# Altium project Proyecto.PrjPcb
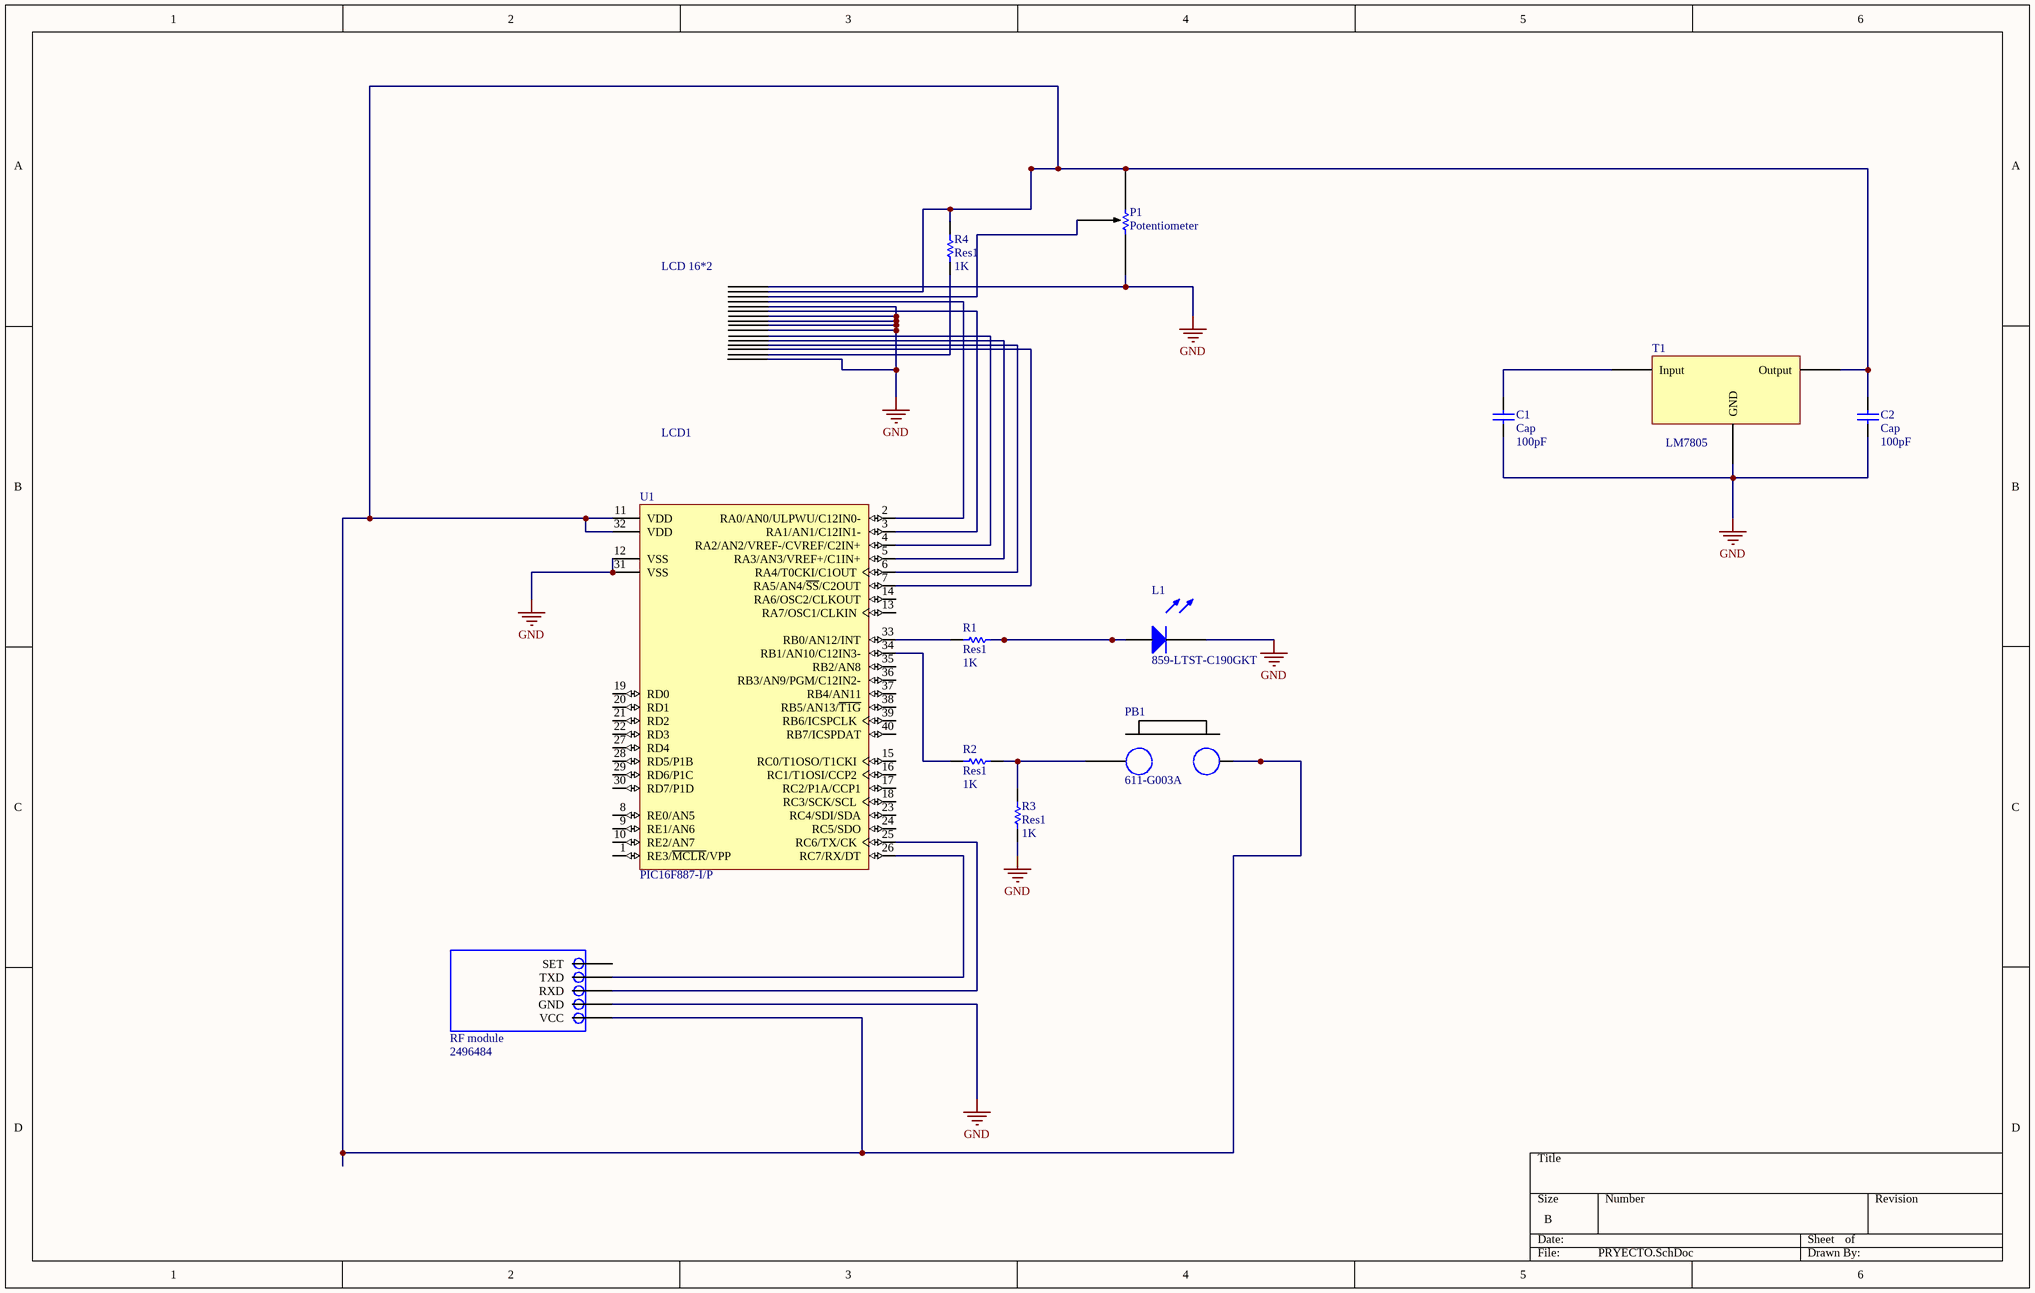
[diagram p0: PRYECTO.SchDoc]
2 sheets, 24 parts. Net scope: global (net labels, ports and power ports of the same name join across sheets).
Board files: FINAL.PcbDoc, Receptorpcb.PcbDoc
Sheets:
  PRYECTO.SchDoc
  RECEPTOR.SchDoc

## Sheet PRYECTO.SchDoc
size B

### Parts
(Parts that share a designator on the sheet are numbered #1, #2 ... from top to bottom, then left to right.)
C1#1  Cap  value 100pF  [RAD-0.3]
C2#1  Cap  value 100pF  [RAD-0.3]
L1#1  Supplier Part Number 1: 859-LTST-C190GKT  [LED]  (hidden comment: LED)
LCD1  LCD 16*2  [LCD]
P1  Potentiometer  [Potentiometer]
PB1#1  Supplier Part Number 1: 611-G003A  [Push Button]  (hidden comment: Push Button 2-Pin)
R1#1  Res1  value 1K  [AXIAL-0.3]
R2#1  Res1  value 1K  [AXIAL-0.3]
R3  Res1  value 1K  [AXIAL-0.3]
R4  Res1  value 1K  [AXIAL-0.3]
T1#1  LM7805  [LM7805]
U1#1  PIC16F887-I/P  [PDIP600-P40]
U2#1  RF module  Supplier Part Number 1: 2496484  [HC-12]

### Nets
GND: C1#1.1 C2#1.1 L1#1.2 LCD1.D0 LCD1.D1 LCD1.D2 LCD1.D3 LCD1.K LCD1.RW LCD1.VSS P1.3 R3.1 T1#1.Ground(GND) U1#1.12(VSS) U1#1.31(VSS) U2#1.4(GND)
NetC1#1_2: C1#1.2 T1#1.Input
NetC2#1_2: C2#1.2 LCD1.VDD P1.1 PB1#1.2 R4.2 T1#1.Output U1#1.11(VDD) U1#1.32(VDD) U2#1.5(VCC)
NetL1#1_1: L1#1.1 R1#1.2
NetLCD1_A: LCD1.A R4.1
NetLCD1_D4: LCD1.D4 U1#1.4(RA2/AN2/VREF-/CVREF/C2IN+)
NetLCD1_D5: LCD1.D5 U1#1.5(RA3/AN3/VREF+/C1IN+)
NetLCD1_D6: LCD1.D6 U1#1.6(RA4/T0CKI/C1OUT)
NetLCD1_D7: LCD1.D7 U1#1.7(RA5/AN4/~{SS}/C2OUT)
NetLCD1_E: LCD1.E U1#1.3(RA1/AN1/C12IN1-)
NetLCD1_RS: LCD1.RS U1#1.2(RA0/AN0/ULPWU/C12IN0-)
NetLCD1_V0: LCD1.V0 P1.2
NetPB1#1_1: PB1#1.1 R2#1.2 R3.2
NetR1#1_1: R1#1.1 U1#1.33(RB0/AN12/INT)
NetR2#1_1: R2#1.1 U1#1.34(RB1/AN10/C12IN3-)
NetU1#1_25: U1#1.25(RC6/TX/CK) U2#1.3(RXD)
NetU1#1_26: U1#1.26(RC7/RX/DT) U2#1.2(TXD)

Not connected (* = marked no-connect by the designer): U1#1 1(RE3/~{MCLR}/VPP) 8(RE0/AN5) 9(RE1/AN6) 10(RE2/AN7) 13(RA7/OSC1/CLKIN) 14(RA6/OSC2/CLKOUT) 15(RC0/T1OSO/T1CKI) 16(RC1/T1OSI/CCP2) 17(RC2/P1A/CCP1) 18(RC3/SCK/SCL) 19(RD0) 20(RD1) 21(RD2) 22(RD3) 23(RC4/SDI/SDA) 24(RC5/SDO) 27(RD4) 28(RD5/P1B) 29(RD6/P1C) 30(RD7/P1D) 35(RB2/AN8) 36(RB3/AN9/PGM/C12IN2-) 37(RB4/AN11) 38(RB5/AN13/~{T1G}) 39(RB6/ICSPCLK) 40(RB7/ICSPDAT); U2#1 1(SET)

### Library data of the parts
C1#1 C2#1 = Cap: Capacitor Ceramico; Manufacturer: KEMET; Manufacturer Part Number: C0402C104K8PACTU; Capacitance: 100nF; Tolerance: 10%; Voltage Rating: 10V; Dielectric: X5R; Dissipation Factor: 5%; Published: 8-Jun-2000; LatestRevisionDate: 17-Jul-2002; LatestRevisionNote: Re-released for DXP Platform.; PackageReference: RAD-0.3; Publisher: Altium Limited; PackageDescription: Radial Cap, Thru-Hole; 2 Leads; 0.3 in Pin Spacing; Supplier 1: Arrow; Stock 1: 0; Mount: PCB,Surface Mount; Case/Package: 0402; Number of Pins: 2; Case Code (Metric): 1005; Case Code (Imperial): 0402; Dielectric Material: Ceramic; Contact Plating: Matte,Tin; Min Operating Temperature: -55°C; Max Operating Temperature: 85°C; Voltage Rating (DC): 10V; Package Quantity: 1; Packaging: Tape and Reel; Termination: SMD/SMT; Voltage: 10V; Length: 1mm; Height: 0.5mm; Width: 0.02inch; Depth: 0.5mm; Thickness: 0.022inch; Lead Pitch: 0.3mm; Radiation Hardening: No; REACH SVHC: No SVHC; Lead Free: Lead Free; Supplier Part Number 1: C0402C104K8PAC7867
L1#1 = LED: Manufacturer: Vishay Lite-On; Manufacturer Part Number: LTST-C190GKT; Colour: Green; Lens Colour: Clear,Colorless; Luminous Intensity: 6mcd; Forward Voltage: 2.1V; Viewing Angle: 130°; Lens Style: Clear,Colorless,Diffused,Rectangular; Forward Current: 30mA; Test Current: 10mA; Number of Elements: 1; Power Dissipation: 100mW; Reverse Voltage: 5V; Dominant Wavelength: 569nm; Wavelength: 565nm; Lens Transparency: Clear; Voltage: 2V; Current: 1A; Supplier 1: Mouser; Stock 1: 402291; Pricing 1: 1=0.25, 10=0.13, 50=0.13, 100=0.061, 1000=0.045, 10000=0.034 (USD); Mount: Surface Mount; Case/Package: 0603; Number of Pins: 2; Case Code (Metric): 1608; Case Code (Imperial): 0603; Min Operating Temperature: -55°C; Max Operating Temperature: 85°C; Package Quantity: 1; Packaging: Tape and Reel; Illumination Colour: Green; Number of LEDs: 1; Power Rating: 100mW; Length: 1.6mm; Height: 0.8mm; Width: 0.8mm; Depth: 0.8mm; Radiation Hardening: No; Lead Free: Lead Free
LCD1 = LCD: Manufacturer: Newhaven Display; Manufacturer Part Number: NHD-0216K3Z-FL-GBW-V3; Interface: I2C,RS-232,SPI; Operating Supply Voltage: 5V; Backlight Type: LED; Number of Characters: 32; Background Colour: Green; Supplier 1: Allied Electronics; Stock 1: 0; Min Operating Temperature: -20°C; Max Operating Temperature: 70°C; Package Quantity: 100; Supplier Part Number 1: 70518162
P1 = Potentiometer: Manufacturer: Bourns; Manufacturer Part Number: 91A1A-G28-B15L; Resistance: 10kR; Tolerance: 20%; Power Rating: 500mW; Number of Gangs: 1; Temperature Coefficient: 1000ppm/°C; Voltage Rating: 1.5kV; Max Power Dissipation: 1W; Actuator Length: 0.875inch; Actuator Diameter: 0.25inch; Hole Diameter: 9.525mm; Supplier 1: Mouser; Stock 1: 86; Pricing 1: 1=7.31, 10=7.05, 50=5.75, 100=5.22, 1000=3.53, 10000=3.53 (USD); Mount: Panel,Through Hole; Case/Package: Metal; Weight: 0.447979oz; Min Operating Temperature: -40°C; Max Operating Temperature: 125°C; Composition: Conductive Plastic; Termination: Pin; Number of Turns: 1; Packaging: Bulk; Package Quantity: 5; Taper: Linear; Voltage Rating (DC): 1.5kV; Length: 15.88mm; Width: 15.88mm; Depth: 22.86mm; REACH SVHC: No SVHC; Supplier Part Number 1: 652-91A1A-G28-B15L
PB1#1 = Push button: Manufacturer: ITT C&K; Manufacturer Part Number: G003A; Shape: Round; Illumination Type: Non-Illuminated; Illumination Colour: Black; Supplier 1: Mouser; Stock 1: 2542; Pricing 1: 1=0.44, 10=0.44, 50=0.425, 100=0.416, 1000=0.296, 10000=0.28 (USD); Colour: Black; Packaging: Bulk; Package Quantity: 500; Diameter: 6.2mm; Height: 9.04mm; Radiation Hardening: No; Lead Free: Lead Free
R1#1 R2#1 R3 R4 = Res1: Resistor; Published: 8-Jun-2000; LatestRevisionDate: 17-Jul-2002; LatestRevisionNote: Re-released for DXP Platform.; PackageReference: AXIAL-0.3; Publisher: Altium Limited; PackageDescription: Axial Device, Thru-Hole; 2 Leads; 0.3 in Pin Spacing
T1#1 = LM7805: Voltage Regulator; Manufacturer: ON Semiconductor / Fairchild; Manufacturer Part Number: LM7805CT; Output Voltage: 5V; Number of Outputs: 1; Max Input Voltage: 35V; Polarity: Positive; Output Type: Fixed; Output Current: 1A; Min Input Voltage: 7V; Quiescent Current: 8mA; Dropout Voltage: 2V; Accuracy: 4%; Power Supply Rejection Ratio (PSRR): 73dB; Max Output Voltage: 5.2V; Supplier 1: Newark; Stock 1: 0; Mount: Through Hole; Case/Package: TO-220-3; Number of Pins: 3; Weight: 1.214g; Min Operating Temperature: -40°C; Max Operating Temperature: 125°C; Packaging: Rail/Tube; Package Quantity: 50; Number of Regulators: 1; Output Voltage Accuracy: 4%; Max Output Current: 1A; Current Rating: 1A; Nominal Output Voltage: 5V; Min Output Voltage: 5V; Length: 10.67mm; Height: 16.3mm; Width: 4.7mm; Radiation Hardening: No; Lead Free: Lead Free; REACH SVHC: No SVHC; Supplier Part Number 1: 34C1092
U1#1 = PIC16F887-I/P: Flash-Based, 8-Bit CMOS Microcontroller with nanoWatt Technology, 8K (x14-Bit words) Program Memory, 624 Bytes Data Memory, 35 I/O pins, 40-Pin PDIP, Standard VDD Range, Industrial Temperature; Published: 29-Jan-2009; LatestRevisionDate: 02-Dec-2009; LatestRevisionNote: Updated datasheet to version revF, Apr-2009.; DatasheetVersion: revF, Apr-2009; PackageVersion: revBB, Aug-2009; PackageReference: PDIP600-P40; Publisher: Altium Limited; PackageDescription: 40-Lead Plastic Dual In-Line (P) - 600 mil Body [PDIP]; Supplier 1: Digi-Key; Supplier Part Number 1: PIC16F887-I/P-ND; Supplier 2: Farnell; Supplier Part Number 2: 1439541; ComponentLink1Description: Datasheet; ComponentLink1URL: http://ww1.microchip.com/downloads/en/DeviceDoc/41291F.pdf; ComponentLink2Description: Packaging Specification; ComponentLink2URL: http://www.microchip.com/stellent/groups/techpub_sg/documents/packagingspec/en012702.pdf; ComponentLink3Description: Microchip.com Home; ComponentLink3URL: http://www.microchip.com/
U2#1 = HC-12: HC-11 1000m; Manufacturer: Microchip; Manufacturer Part Number: MRF89XAM8A-I/RM; Max Supply Voltage: 3.6V; Min Supply Voltage: 2.1V; Operating Supply Voltage: 3.3V; Data Rate: 40Kbps; Number of Channels: 59; Nominal Supply Current: 25mA; Interface: SPI; Frequency: 870MHz; Sensitivity: -113dBm; Current - Receiving: 3mA; Logic Function: Transceiver; Propagation Delay: 25ns; Number of Transmitters: 1; Simplex/Duplex: Half Duplex; Operating Supply Current: 18mA; Mount: Surface Mount; Case/Package: Module; Number of Pins: 12; Contact Plating: Matte,Tin; Min Operating Temperature: -40°C; Max Operating Temperature: 85°C; Packaging: Tray; Package Quantity: 54; Max Frequency: 870MHz; Current - Transmitting: 25mA; Length: 27.94mm; Height: 0.075inch; Width: 0.7inch; Depth: 17.78mm; Radiation Hardening: No; Lead Free: Lead Free; REACH SVHC: No SVHC; Supplier 1: Farnell; Stock 1: 13; Pricing 1: 1=49.59, 5=48.04, 10=47.12, 25=40.3 (GBP); Weight: 0.004706oz; Number of Receivers: 1; Number of Drivers: 1; Number of Transceivers: 1

## Sheet RECEPTOR.SchDoc
size A
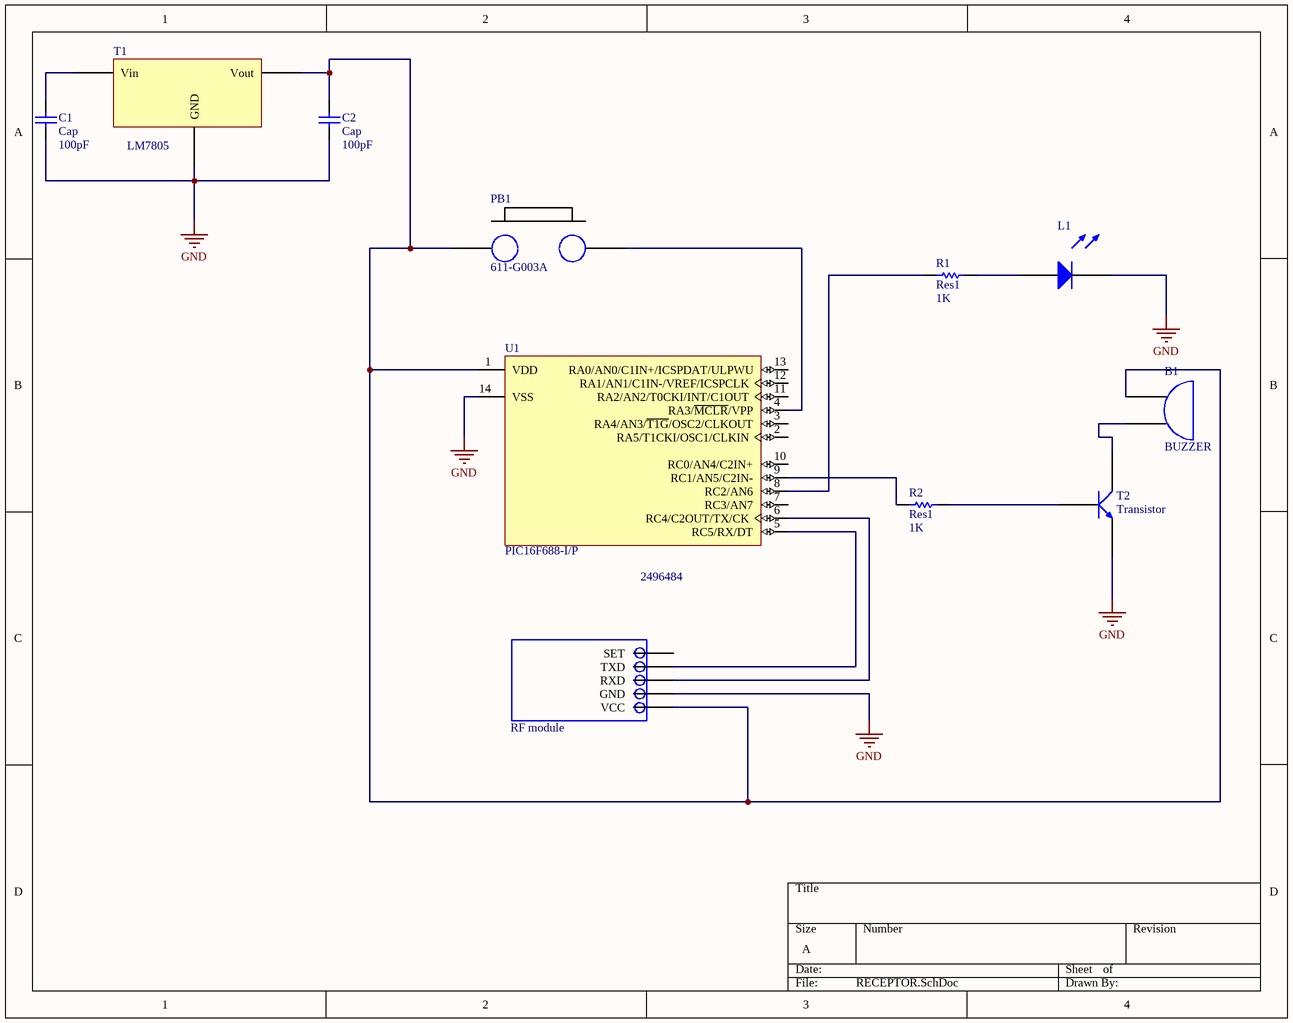
[diagram p1: RECEPTOR.SchDoc]

### Parts
(Parts that share a designator on the sheet are numbered #1, #2 ... from top to bottom, then left to right.)
B1  BUZZER  [Buzzer]
C1#2  Cap  value 100pF  [RAD-0.3]
C2#2  Cap  value 100pF  [RAD-0.3]
L1#2  LED  [LED]  (value not drawn)
PB1#2  Supplier Part Number 1: 611-G003A  [Push Button]  (hidden comment: Push Button 2-Pin)
R1#2  Res1  value 1K  [AXIAL-0.3]
R2#2  Res1  value 1K  [AXIAL-0.3]
T1#2  LM7805  [LM7805]
T2  Transistor  [2N2222a]
U1#2  PIC16F688-I/P  [PDIP300-P14]
U2#2  RF module  Supplier Part Number 1: 2496484  [HC-12]

### Nets
GND: C1#2.1 C2#2.1 L1#2.2 T1#2.174(GND) T2.34(E) U1#2.14(VSS) U2#2.4(GND)
NetB1_1: B1.1(VCC) C2#2.2 PB1#2.1 T1#2.175(Vout) U1#2.1(VDD) U2#2.5(VCC)
NetB1_36: B1.36(VEE) T2.1(C)
NetC1#2_2: C1#2.2 T1#2.173(Vin)
NetL1#2_1: L1#2.1 R1#2.2
NetPB1#2_2: PB1#2.2 U1#2.4(RA3/~{MCLR}/VPP)
NetR1#2_1: R1#2.1 U1#2.8(RC2/AN6)
NetR2#2_1: R2#2.1 U1#2.9(RC1/AN5/C2IN-)
NetR2#2_2: R2#2.2 T2.33(B)
NetU1#2_5: U1#2.5(RC5/RX/DT) U2#2.2(TXD)
NetU1#2_6: U1#2.6(RC4/C2OUT/TX/CK) U2#2.3(RXD)

Not connected (* = marked no-connect by the designer): U1#2 2(RA5/T1CKI/OSC1/CLKIN) 3(RA4/AN3/~{T1G}/OSC2/CLKOUT) 7(RC3/AN7) 10(RC0/AN4/C2IN+) 11(RA2/AN2/T0CKI/INT/C1OUT) 12(RA1/AN1/C1IN-/VREF/ICSPCLK) 13(RA0/AN0/C1IN+/ICSPDAT/ULPWU); U2#2 1(SET)

### Library data of the parts
B1 = BUZZER: Buzzer 3-12V; Manufacturer: Murata; Manufacturer Part Number: PKB24SPCH3601-B0; Frequency: 3.6kHz; Max Supply Voltage: 15V; Voltage Rating: 12V; Min Supply Voltage: 3V; Max Frequency: 4.1kHz; Nominal Supply Current: 16mA; Washable: No; Supplier 1: RSComponents; Stock 1: 0; Mount: Flush,PCB,Through Hole; Min Operating Temperature: -20°C; Max Operating Temperature: 70°C; Termination: PC Pins; Self Resonant Frequency: 3.6kHz; Package Quantity: 650; Packaging: Bulk; Voltage Rating (DC): 15V; Nominal Supply Voltage (DC): 12V; Max Supply Voltage (DC): 15V; Min Supply Voltage (DC): 3V; Operating Supply Current: 16mA; Max Supply Current: 16mA; Diameter: 24.3mm; Length: 24.3mm; Height: 9.7mm; Radiation Hardening: No; REACH SVHC: No SVHC; Lead Free: Lead Free; Supplier Part Number 1: 5168274P
C1#2 C2#2 = Cap: as C1#1 on sheet PRYECTO; Published: 8-Jun-2000; LatestRevisionDate: 17-Jul-2002; LatestRevisionNote: Re-released for DXP Platform.; PackageReference: RAD-0.3; Publisher: Altium Limited; PackageDescription: Radial Cap, Thru-Hole; 2 Leads; 0.3 in Pin Spacing; Supplier 1: Arrow; Stock 1: 0; Mount: PCB,Surface Mount; Case/Package: 0402; Number of Pins: 2; Case Code (Metric): 1005; Case Code (Imperial): 0402; Dielectric Material: Ceramic; Contact Plating: Matte,Tin; Min Operating Temperature: -55°C; Max Operating Temperature: 85°C; Voltage Rating (DC): 10V; Package Quantity: 1; Packaging: Tape and Reel; Termination: SMD/SMT; Voltage: 10V; Length: 1mm; Height: 0.5mm; Width: 0.02inch; Depth: 0.5mm; Thickness: 0.022inch; Lead Pitch: 0.3mm; Radiation Hardening: No; REACH SVHC: No SVHC; Lead Free: Lead Free; Supplier Part Number 1: C0402C104K8PAC7867
L1#2 = LED: as L1#1 on sheet PRYECTO; Supplier 1: Mouser; Stock 1: 402291; Pricing 1: 1=0.25, 10=0.13, 50=0.13, 100=0.061, 1000=0.045, 10000=0.034 (USD); Mount: Surface Mount; Case/Package: 0603; Number of Pins: 2; Case Code (Metric): 1608; Case Code (Imperial): 0603; Min Operating Temperature: -55°C; Max Operating Temperature: 85°C; Package Quantity: 1; Packaging: Tape and Reel; Illumination Colour: Green; Number of LEDs: 1; Power Rating: 100mW; Length: 1.6mm; Height: 0.8mm; Width: 0.8mm; Depth: 0.8mm; Radiation Hardening: No; Lead Free: Lead Free; Supplier Part Number 1: 859-LTST-C190GKT
PB1#2 = Push button: as PB1#1 on sheet PRYECTO; Supplier 1: Mouser; Stock 1: 2542; Pricing 1: 1=0.44, 10=0.44, 50=0.425, 100=0.416, 1000=0.296, 10000=0.28 (USD); Colour: Black; Packaging: Bulk; Package Quantity: 500; Diameter: 6.2mm; Height: 9.04mm; Radiation Hardening: No; Lead Free: Lead Free
R1#2 R2#2 = Res1: Resistor; Published: 8-Jun-2000; LatestRevisionDate: 17-Jul-2002; LatestRevisionNote: Re-released for DXP Platform.; PackageReference: AXIAL-0.3; Publisher: Altium Limited; PackageDescription: Axial Device, Thru-Hole; 2 Leads; 0.3 in Pin Spacing
T1#2 = LM7805: as T1#1 on sheet PRYECTO; Supplier 1: Newark; Stock 1: 0; Mount: Through Hole; Case/Package: TO-220-3; Number of Pins: 3; Weight: 1.214g; Min Operating Temperature: -40°C; Max Operating Temperature: 125°C; Packaging: Rail/Tube; Package Quantity: 50; Number of Regulators: 1; Output Voltage Accuracy: 4%; Max Output Current: 1A; Current Rating: 1A; Nominal Output Voltage: 5V; Min Output Voltage: 5V; Length: 10.67mm; Height: 16.3mm; Width: 4.7mm; Radiation Hardening: No; Lead Free: Lead Free; REACH SVHC: No SVHC; Supplier Part Number 1: 34C1092
T2 = 2N2222A: Manufacturer: NTE Electronics; Polarity: NPN; Collector Emitter Breakdown Voltage: 40V; Max Power Dissipation: 1.2W; Transition Frequency: 300MHz; Supplier 1: Allied Electronics; Manufacturer Part Number: 2N2222A; Stock 1: 4414; Pricing 1: 1=0.48 (USD); Case/Package: TO-18; Number of Pins: 3; Max Operating Temperature: 200°C; Collector Emitter Voltage (VCEO): 40V; Lead Free: Contains Lead; REACH SVHC: No SVHC; Supplier Part Number 1: 70725575
U1#2 = PIC16F688-I/P: FLASH-Based 8-Bit CMOS Microcontroller, 10-Bit A/D, 4K (x14-Bit words) FLASH, 256 Bytes SRAM, 14-Pin PDIP, Industrial Temperature; Published: 11-Oct-2004; LatestRevisionDate: 29-Jan-2009; LatestRevisionNote: Sch. layout revised. 3D Model Removed.; DatasheetVersion: revD, Feb-2007; PackageVersion: revBB, Aug-2009; PackageReference: PDIP300-P14; Publisher: Altium Limited; PackageDescription: 14-Lead Plastic Dual In-Line (P) - 300 mil Body [PDIP]; Supplier 1: Digi-Key; Supplier Part Number 1: PIC16F688-I/P-ND; ComponentLink1Description: Datasheet; ComponentLink1URL: http://ww1.microchip.com/downloads/en/DeviceDoc/41203D.pdf; ComponentLink2Description: Packaging Specification; ComponentLink2URL: http://www.microchip.com/stellent/groups/techpub_sg/documents/packagingspec/en012702.pdf; ComponentLink3Description: Microchip.com Home; ComponentLink3URL: http://www.microchip.com/
U2#2 = HC-12: as U2#1 on sheet PRYECTO; Mount: Surface Mount; Case/Package: Module; Number of Pins: 12; Contact Plating: Matte,Tin; Min Operating Temperature: -40°C; Max Operating Temperature: 85°C; Packaging: Tray; Package Quantity: 54; Max Frequency: 870MHz; Current - Transmitting: 25mA; Length: 27.94mm; Height: 0.075inch; Width: 0.7inch; Depth: 17.78mm; Radiation Hardening: No; Lead Free: Lead Free; REACH SVHC: No SVHC; Supplier 1: Farnell; Stock 1: 13; Pricing 1: 1=49.59, 5=48.04, 10=47.12, 25=40.3 (GBP); Weight: 0.004706oz; Number of Receivers: 1; Number of Drivers: 1; Number of Transceivers: 1

## Nets that join several sheets
GND: PRYECTO (16 pins), RECEPTOR (7 pins)